# Altium schematic sheet L298.SchDoc
size A4
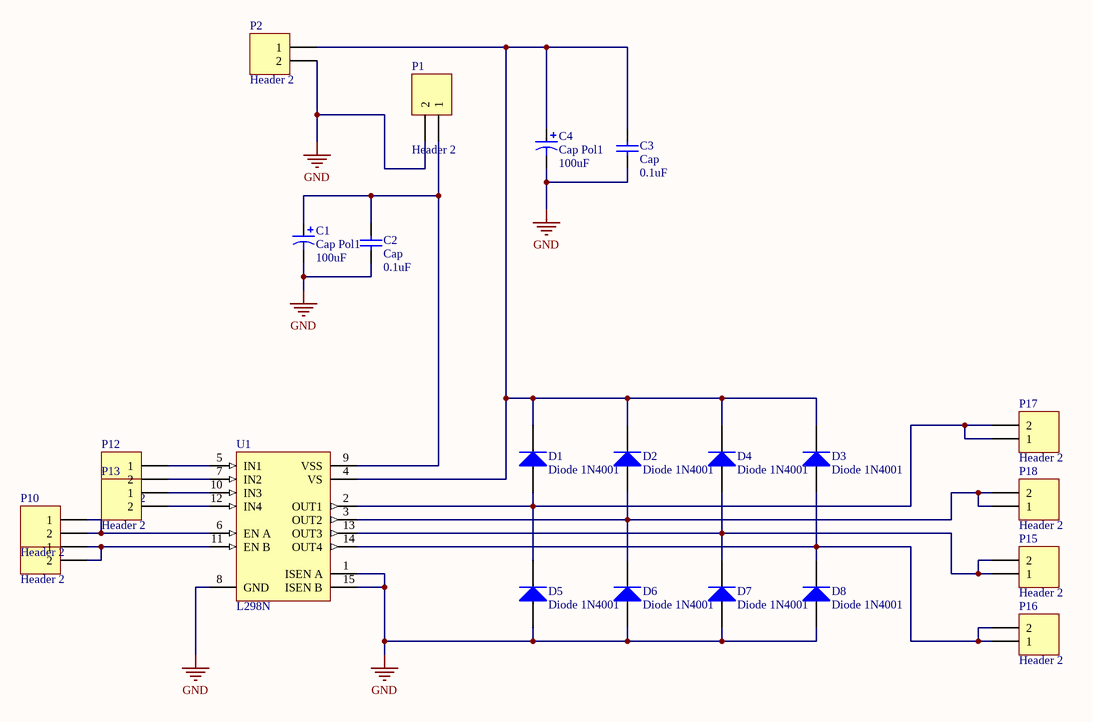
[diagram p0: L298.SchDoc]

## Parts
C1  Cap Pol1  value 100uF  [RB7.6-15]
C2  Cap  value 0.1uF  [RAD-0.3]
C3  Cap  value 0.1uF  [RAD-0.3]
C4  Cap Pol1  value 100uF  [RB7.6-15]
D1  Diode 1N4001  [DO-41]
D2  Diode 1N4001  [DO-41]
D3  Diode 1N4001  [DO-41]
D4  Diode 1N4001  [DO-41]
D5  Diode 1N4001  [DO-41]
D6  Diode 1N4001  [DO-41]
D7  Diode 1N4001  [DO-41]
D8  Diode 1N4001  [DO-41]
P1  Header 2  [HDR1X2]
P2  Header 2  [HDR1X2]
P10  Header 2  [HDR1X2]
P11  Header 2  [HDR1X2]
P12  Header 2  [HDR1X2]
P13  Header 2  [HDR1X2]
P15  Header 2  [HDR1X2]
P16  Header 2  [HDR1X2]
P17  Header 2  [HDR1X2]
P18  Header 2  [HDR1X2]
U1  L298N  [Multiwatt15V]

## Nets
GND: C1.2 C2.1 C3.1 C4.2 D5.1(A) D6.1(A) D7.1(A) D8.1(A) P1.2 P2.2 U1.1(ISEN_A) U1.8(GND) U1.15(ISEN_B)
NetC1_1: C1.1 C2.2 P1.1 U1.9(VSS)
NetC3_2: C3.2 C4.1 D1.2(K) D2.2(K) D3.2(K) D4.2(K) P2.1 U1.4(VS)
NetD1_1: D1.1(A) D5.2(K) P17.1 P17.2 U1.2(OUT1)
NetD2_1: D2.1(A) D6.2(K) P18.1 P18.2 U1.3(OUT2)
NetD3_1: D3.1(A) D8.2(K) P16.1 P16.2 U1.14(OUT4)
NetD4_1: D4.1(A) D7.2(K) P15.1 P15.2 U1.13(OUT3)
NetP10_1: P10.1 P10.2 U1.6(EN_A)
NetP11_1: P11.1 P11.2 U1.11(EN_B)
NetP12_1: P12.1 U1.5(IN1)
NetP12_2: P12.2 U1.7(IN2)
NetP13_1: P13.1 U1.10(IN3)
NetP13_2: P13.2 U1.12(IN4)

## Library data of the parts
C1 C4 = Cap Pol1: Polarized Capacitor (Radial); Published: 8-Jun-2000; LatestRevisionDate: 17-Jul-2002; LatestRevisionNote: Re-released for DXP Platform.; PackageReference: RB7.6-15; Publisher: Altium Limited; PackageDescription: Polarized Capacitor (Radial); 2 Leads
C2 C3 = Cap: Capacitor; Published: 8-Jun-2000; LatestRevisionDate: 17-Jul-2002; LatestRevisionNote: Re-released for DXP Platform.; PackageReference: RAD-0.3; Publisher: Altium Limited; PackageDescription: Radial Cap, Thru-Hole; 2 Leads; 0.3 in Pin Spacing
D1-D8 = Diode 1N4001: 1 Amp General Purpose Rectifier; Published: 8-Jun-2000; LatestRevisionDate: 17-Jul-2002; LatestRevisionNote: Re-released for DXP Platform.; DatasheetVersion: 1998; PackageVersion: Aug-1999; PackageReference: DO-41; Publisher: Altium Limited; PackageDescription: Diode, Axial; Body 5.2 x 2.7 mm (LxDia. max), Lead Dia. 0.86 mm (max); Code_JEDEC: DO-204-AL; ComponentLink1Description: Manufacturer Link; ComponentLink1URL: http://www.fairchildsemi.com/; ComponentLink2Description: Datasheet; ComponentLink2URL: http://www.fairchildsemi.com/ds/1N%2F1N4001.pdf
P1 P2 P10-P13 P15-P18 = Header 2: Header, 2-Pin; LatestRevisionDate: 17-Jul-2002; LatestRevisionNote: Re-released for DXP Platform.; Publisher: Altium Limited
U1 = L298N: Dual Full Bridge Driver; Published: 8-Jun-2000; LatestRevisionDate: 14-May-2007; LatestRevisionNote: Mapped to vertical PCB.; DatasheetVersion: Jul-1999; PackageReference: Multiwatt15V; Publisher: Altium Limited; PackageDescription: TO, Thru-Hole, Vertical, Heatsink Mounted; 15 Bent Staggered Leads; Pitch 1.27 mm; ComponentLink1Description: Manufacturer Link; ComponentLink1URL: http://www.st.com/; ComponentLink2Description: Datasheet; ComponentLink2URL: http://www.st.com/stonline/products/literature/ds/1773/l298.pdf